# EAGLE schematic garw_joystick (EAGLE 9.2.2)
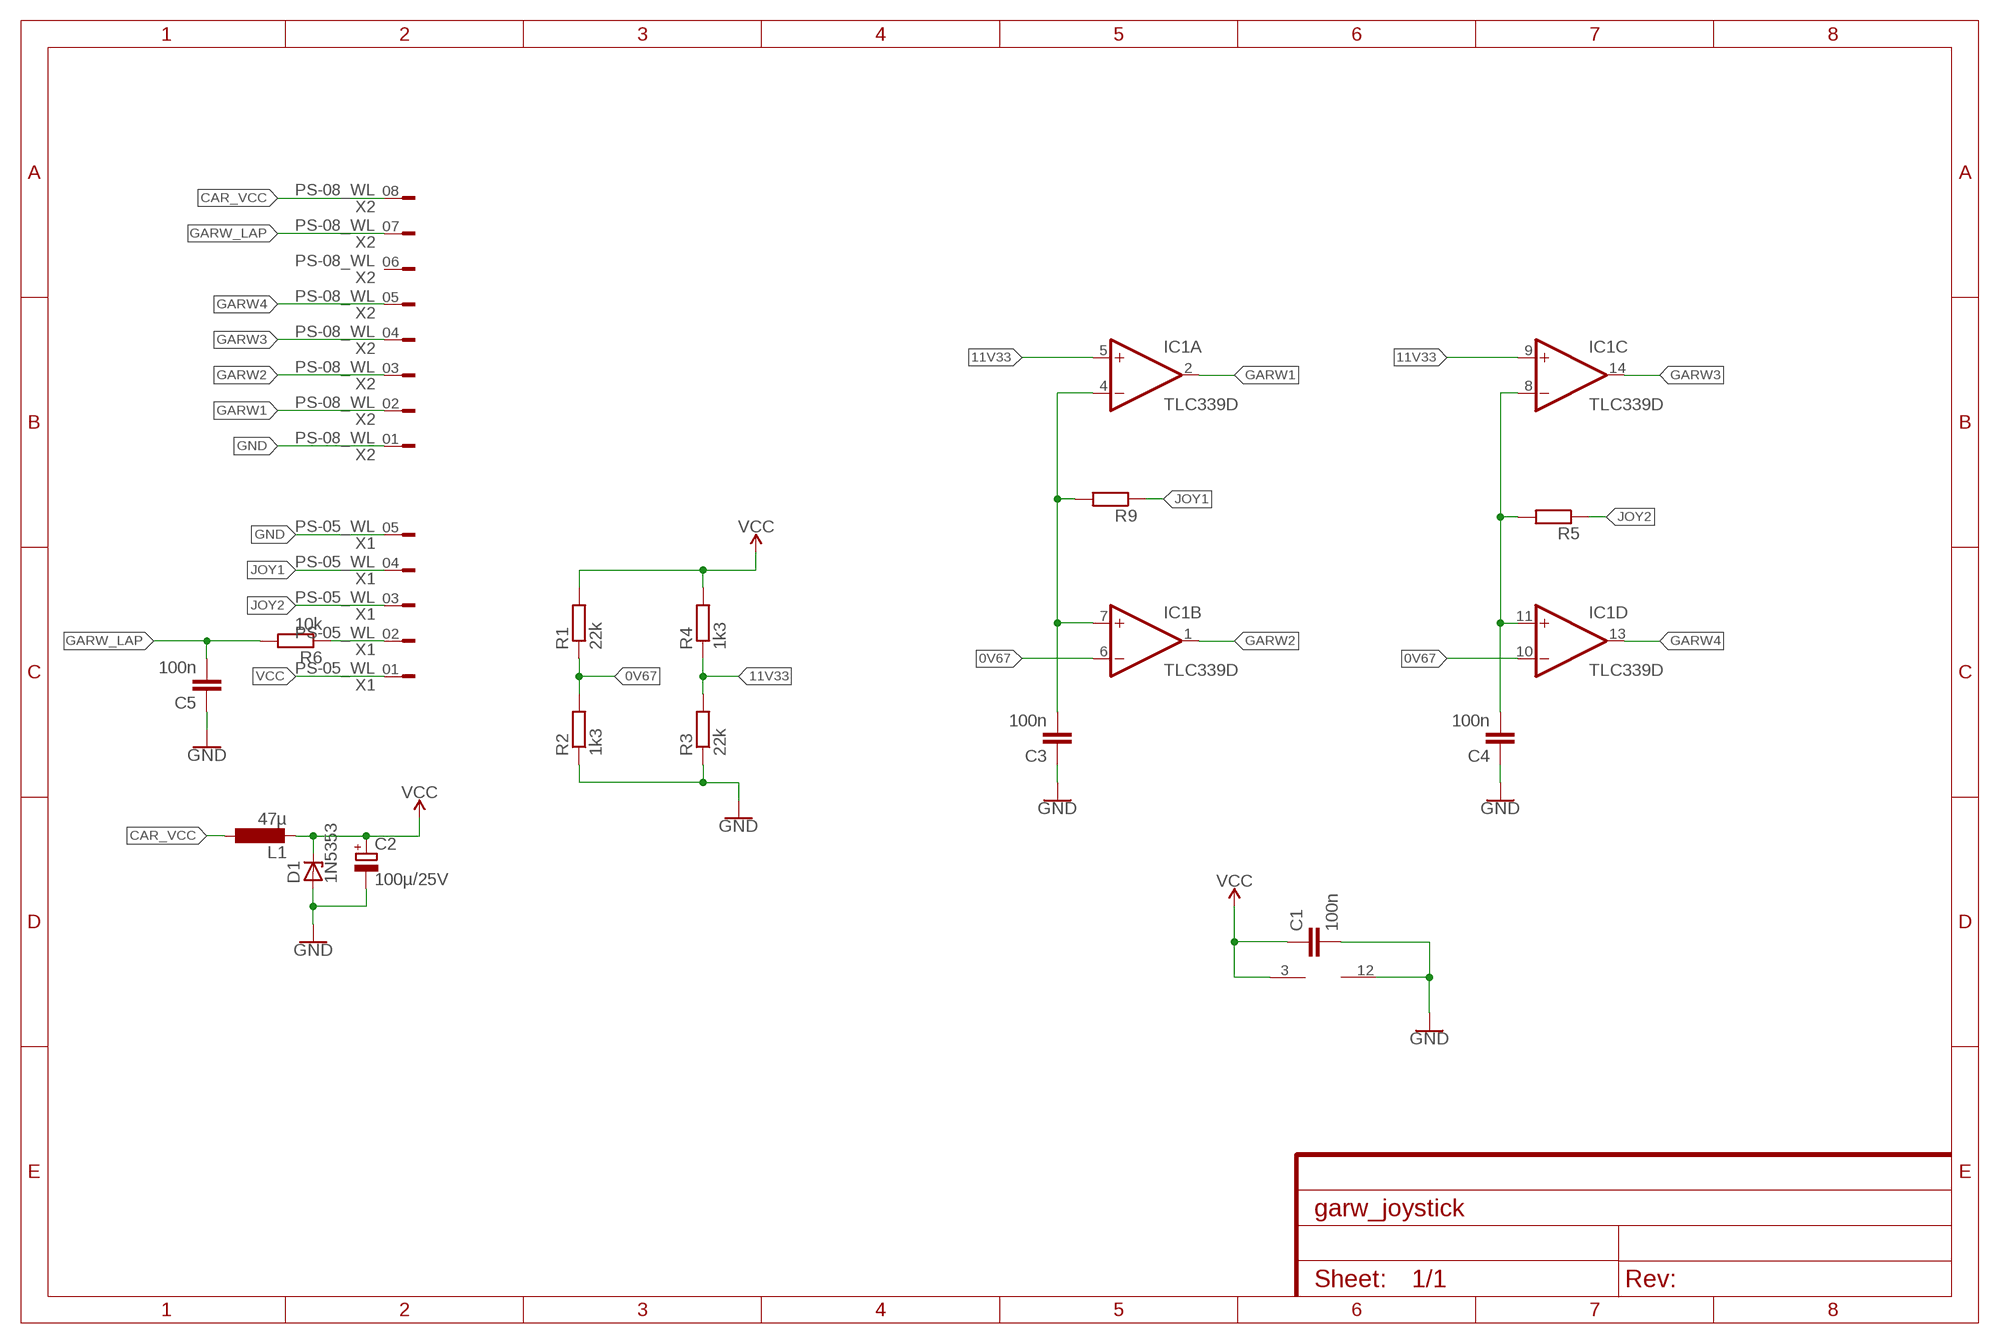
[diagram p0: schematic, sheet 1]

## Parts
C1  100n  C-EUC0805  [C0805]
C2  100µ/25V  CPOL-EU153CLV-0605  [153CLV-0605]
C3  100n  C-EUC0805  [C0805]
C4  100n  C-EUC0805  [C0805]
C5  100n  C-EUC0805  [C0805]
D1  1N5353  ZENER-DIODEDO35Z10  [DO35Z10]
IC1  TLC339D  [SO14]
L1  47µ  L-EU0204/7  [0204/7]
R1  22k  R-EU_M0805  [M0805]
R2  1k3  R-EU_M0805  [M0805]
R3  22k  R-EU_M0805  [M0805]
R4  1k3  R-EU_M0805  [M0805]
R5  R-EU_M0805  [M0805]
R6  10k  R-EU_M0805  [M0805]
R9  R-EU_M0805  [M0805]
X1  PS-05_WL  [PS-05_WL]
X2  PS-08_WL  [PS-08_WL]

## Nets
0V67: IC1.6(B:-IN) IC1.10(D:-IN) R1.1 R2.2
11V33: IC1.5(A:+IN) IC1.9(C:+IN) R3.2 R4.1
CAR_VCC: L1.1 X2.08
GARW1: IC1.2(A:OUT) X2.02
GARW2: IC1.1(B:OUT) X2.03
GARW3: IC1.14(C:OUT) X2.04
GARW4: IC1.13(D:OUT) X2.05
GARW_LAP: C5.2 R6.2 X2.07
GND: C1.2 C2.- C3.1 C4.1 C5.1 D1.A IC1.12(P:V-) R2.1 R3.1 X1.05 X2.01
JOY1: R9.1 X1.04
JOY2: R5.1 X1.03
N$1: R6.1 X1.02
N$5: C4.2 IC1.8(C:-IN) IC1.11(D:+IN) R5.2
N$8: C3.2 IC1.4(A:-IN) IC1.7(B:+IN) R9.2
VCC: C1.1 C2.+ D1.C IC1.3(P:V+) L1.2 R1.2 R4.2 X1.01
Unconnected: X2.06

## Library data of the parts
C1 C3-C5 = rcl:C-EU: CAPACITOR, European symbol; SPICEPREFIX: C
C2 = rcl:CPOL-EU: POLARIZED CAPACITOR, European symbol; SPICEPREFIX: C
D1 = diode:ZENER-DIODE: Z-Diode
IC1 = linear:TLC339: COMPARATOR
L1 = rcl:L-EU: INDUCTOR, European symbol; SPICEPREFIX: L
R1-R6 R9 = rcl:R-EU_: RESISTOR, European symbol; SPICEPREFIX: R
X1 = _TEC_Reichelt-PS_r630:PS-05
X2 = _TEC_Reichelt-PS_r630:PS-08